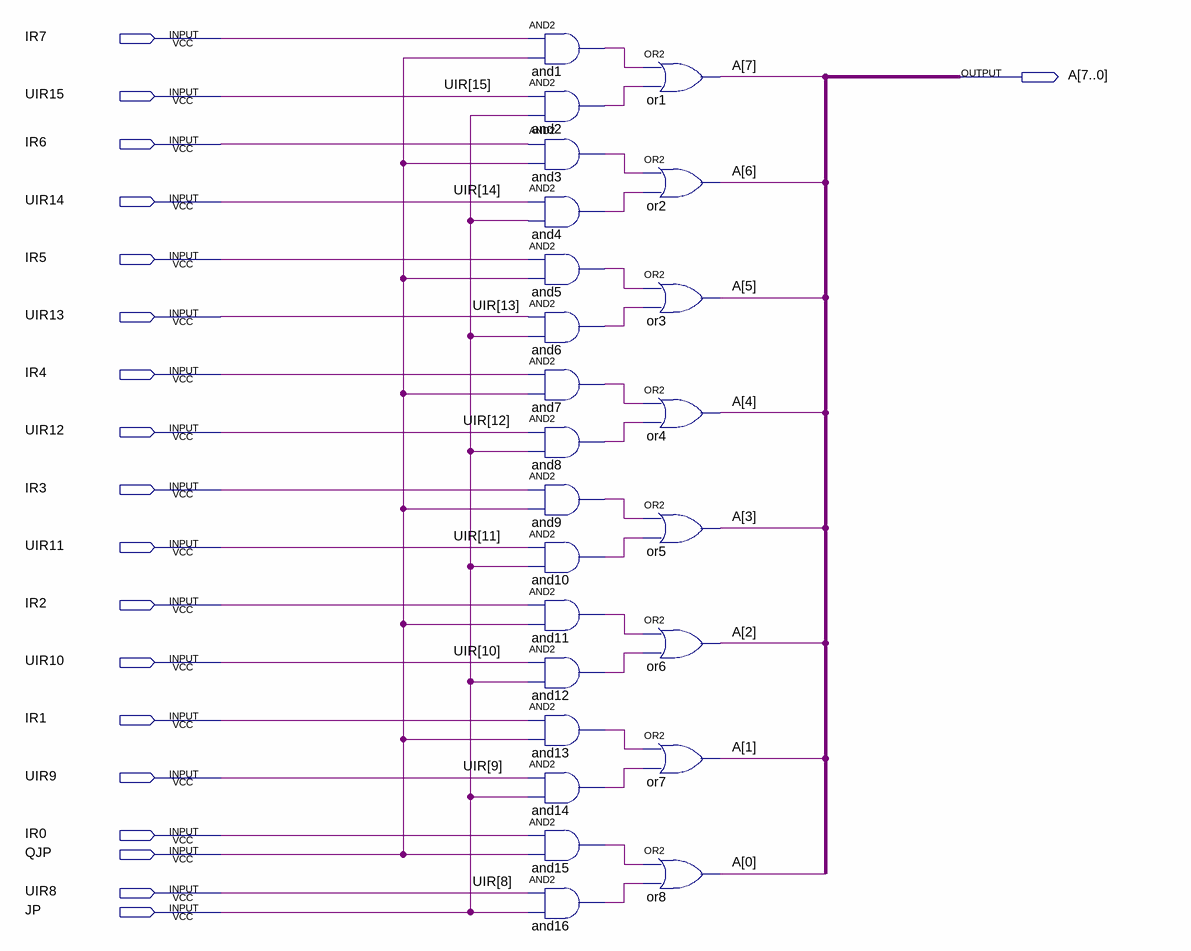
[diagram p0: schematic sheet]
// Quartus schematic ASEL.bdf as structural Verilog: 24 symbols, 19 pins
module ASEL (
  input  IR7,
  input  UIR15,
  input  IR6,
  input  UIR14,
  input  IR5,
  input  UIR13,
  input  IR4,
  input  UIR12,
  input  IR3,
  input  UIR11,
  input  IR2,
  input  UIR10,
  input  IR1,
  input  UIR9,
  input  IR0,
  input  QJP,
  input  UIR8,
  input  JP,
  output [7:0] A
);

  wire and1_out, and2_out, and3_out, and4_out, and5_out, and6_out, and7_out, and8_out, and9_out, and10_out,
       and11_out, and12_out, and13_out, and14_out, and15_out, and16_out;

  and and1 (and1_out, IR7, QJP);
  and and2 (and2_out, UIR15, JP);
  and and3 (and3_out, IR6, QJP);
  and and4 (and4_out, UIR14, JP);
  and and5 (and5_out, IR5, QJP);
  and and6 (and6_out, UIR13, JP);
  and and7 (and7_out, IR4, QJP);
  and and8 (and8_out, UIR12, JP);
  and and9 (and9_out, IR3, QJP);
  and and10 (and10_out, UIR11, JP);
  and and11 (and11_out, IR2, QJP);
  and and12 (and12_out, UIR10, JP);
  and and13 (and13_out, IR1, QJP);
  and and14 (and14_out, UIR9, JP);
  and and15 (and15_out, IR0, QJP);
  and and16 (and16_out, UIR8, JP);
  or or1 (A[7], and1_out, and2_out);
  or or2 (A[6], and3_out, and4_out);
  or or3 (A[5], and5_out, and6_out);
  or or4 (A[4], and7_out, and8_out);
  or or5 (A[3], and9_out, and10_out);
  or or6 (A[2], and11_out, and12_out);
  or or7 (A[1], and13_out, and14_out);
  or or8 (A[0], and15_out, and16_out);
endmodule
